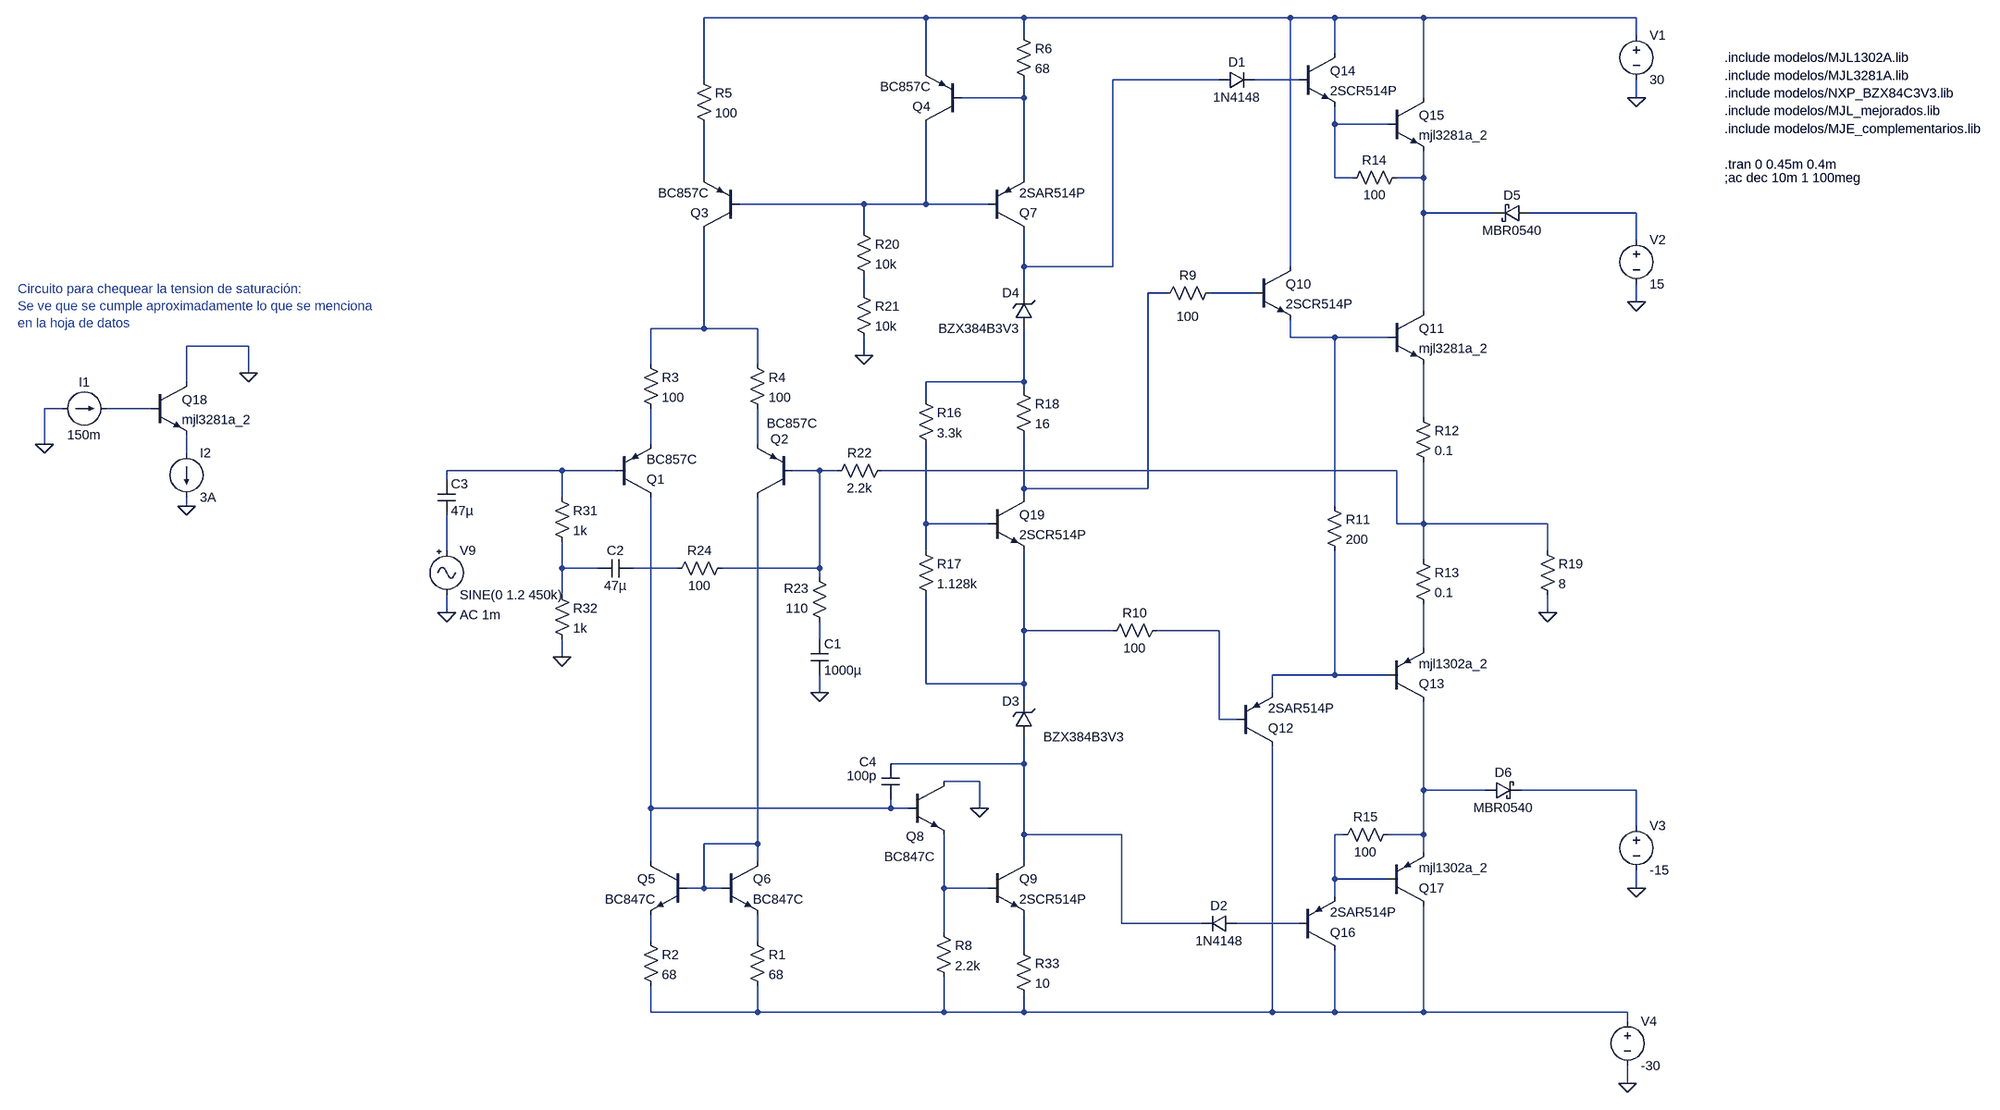
[diagram p0: schematic tp_final_amplificador.asc]
tp_final_amplificador.asc, the LTspice schematic file:
Version 4
SHEET 1 1772 1504
WIRE -1264 -640 -1664 -640
WIRE -1088 -640 -1264 -640
WIRE -608 -640 -1088 -640
WIRE -528 -640 -608 -640
WIRE -368 -640 -528 -640
WIRE 16 -640 -368 -640
WIRE -1088 -608 -1088 -640
WIRE 16 -608 16 -640
WIRE -528 -576 -528 -640
WIRE -1264 -544 -1264 -640
WIRE -1664 -528 -1664 -640
WIRE -736 -528 -928 -528
WIRE -592 -528 -672 -528
WIRE -1088 -496 -1088 -528
WIRE -1088 -496 -1200 -496
WIRE -368 -496 -368 -640
WIRE 16 -496 16 -528
WIRE -528 -448 -528 -480
WIRE -432 -448 -528 -448
WIRE -1664 -352 -1664 -448
WIRE -1088 -352 -1088 -496
WIRE -528 -352 -528 -448
WIRE -496 -352 -528 -352
WIRE -368 -352 -368 -400
WIRE -368 -352 -416 -352
WIRE -1376 -304 -1600 -304
WIRE -1264 -304 -1264 -448
WIRE -1264 -304 -1376 -304
WIRE -1152 -304 -1264 -304
WIRE -368 -288 -368 -352
WIRE -240 -288 -368 -288
WIRE 16 -288 -176 -288
WIRE -1376 -256 -1376 -304
WIRE 16 -240 16 -288
WIRE -1088 -192 -1088 -256
WIRE -928 -192 -928 -528
WIRE -928 -192 -1088 -192
WIRE -608 -192 -608 -640
WIRE -1376 -144 -1376 -176
WIRE -1088 -144 -1088 -192
WIRE -832 -144 -864 -144
WIRE -672 -144 -752 -144
WIRE 16 -128 16 -160
WIRE -368 -112 -368 -288
WIRE -1664 -80 -1664 -256
WIRE -1664 -80 -1760 -80
WIRE -1568 -80 -1664 -80
WIRE -608 -64 -608 -96
WIRE -528 -64 -608 -64
WIRE -432 -64 -528 -64
WIRE -3040 -48 -3152 -48
WIRE -1376 -32 -1376 -64
WIRE -1760 -16 -1760 -80
WIRE -1568 -16 -1568 -80
WIRE -3040 0 -3040 -48
WIRE -3152 16 -3152 -48
WIRE -1088 16 -1088 -80
WIRE -1088 16 -1264 16
WIRE -1088 32 -1088 16
WIRE -1264 48 -1264 16
WIRE -3376 64 -3408 64
WIRE -3216 64 -3296 64
WIRE -368 80 -368 -16
WIRE -3408 128 -3408 64
WIRE -1760 128 -1760 64
WIRE -1568 128 -1568 64
WIRE -3152 144 -3152 112
WIRE -1920 176 -2128 176
WIRE -1824 176 -1920 176
WIRE -1456 176 -1504 176
WIRE -1424 176 -1456 176
WIRE -416 176 -1344 176
WIRE -2128 192 -2128 176
WIRE -1088 208 -1088 112
WIRE -864 208 -864 -144
WIRE -864 208 -1088 208
WIRE -1920 224 -1920 176
WIRE -1088 224 -1088 208
WIRE -3152 240 -3152 224
WIRE -528 240 -528 -64
WIRE -1264 272 -1264 128
WIRE -1152 272 -1264 272
WIRE -416 272 -416 176
WIRE -368 272 -368 160
WIRE -368 272 -416 272
WIRE -144 272 -368 272
WIRE -2128 320 -2128 256
WIRE -1264 320 -1264 272
WIRE -144 320 -144 272
WIRE -368 336 -368 272
WIRE -1920 352 -1920 304
WIRE -1856 352 -1920 352
WIRE -1712 352 -1792 352
WIRE -1456 352 -1456 176
WIRE -1456 352 -1632 352
WIRE -1456 368 -1456 352
WIRE -1920 400 -1920 352
WIRE -2128 432 -2128 400
WIRE -144 432 -144 400
WIRE -1088 464 -1088 320
WIRE -928 464 -1088 464
WIRE -736 464 -848 464
WIRE -1456 480 -1456 448
WIRE -368 496 -368 416
WIRE -1920 512 -1920 480
WIRE -528 544 -528 320
WIRE -528 544 -640 544
WIRE -432 544 -528 544
WIRE -1264 560 -1264 400
WIRE -1088 560 -1088 464
WIRE -1088 560 -1264 560
WIRE -1456 576 -1456 544
WIRE -640 576 -640 544
WIRE -1088 592 -1088 560
WIRE -736 624 -736 464
WIRE -704 624 -736 624
WIRE -1088 704 -1088 656
WIRE -1088 704 -1328 704
WIRE -1168 736 -1232 736
WIRE -368 752 -368 592
WIRE -256 752 -368 752
WIRE 16 752 -192 752
WIRE -1760 784 -1760 224
WIRE -1328 784 -1328 768
WIRE -1328 784 -1760 784
WIRE -1296 784 -1328 784
WIRE -1168 784 -1168 736
WIRE 16 816 16 752
WIRE -1088 832 -1088 704
WIRE -912 832 -1088 832
WIRE -512 832 -528 832
WIRE -368 832 -368 752
WIRE -368 832 -432 832
WIRE -1568 848 -1568 224
WIRE -1568 848 -1664 848
WIRE -368 864 -368 832
WIRE -1760 880 -1760 784
WIRE -1568 880 -1568 848
WIRE -1088 880 -1088 832
WIRE -528 912 -528 832
WIRE -432 912 -528 912
WIRE -1664 928 -1664 848
WIRE -1664 928 -1696 928
WIRE -1632 928 -1664 928
WIRE -1232 928 -1232 832
WIRE -1152 928 -1232 928
WIRE 16 928 16 896
WIRE -528 944 -528 912
WIRE -912 992 -912 832
WIRE -768 992 -912 992
WIRE -592 992 -704 992
WIRE -1232 1008 -1232 928
WIRE -1760 1024 -1760 976
WIRE -1568 1024 -1568 976
WIRE -1088 1040 -1088 976
WIRE -1760 1152 -1760 1104
WIRE -1568 1152 -1568 1104
WIRE -1568 1152 -1760 1152
WIRE -1232 1152 -1232 1088
WIRE -1232 1152 -1568 1152
WIRE -1088 1152 -1088 1120
WIRE -1088 1152 -1232 1152
WIRE -640 1152 -640 672
WIRE -640 1152 -1088 1152
WIRE -528 1152 -528 1040
WIRE -528 1152 -640 1152
WIRE -368 1152 -368 960
WIRE -368 1152 -528 1152
WIRE 0 1152 -368 1152
WIRE 0 1168 0 1152
WIRE 0 1280 0 1248
FLAG -1168 784 0
FLAG -144 432 0
FLAG 0 1280 0
FLAG 16 928 0
FLAG 16 -128 0
FLAG 16 -496 0
FLAG -1376 -32 0
FLAG -1456 576 0
FLAG -1920 512 0
FLAG -2128 432 0
FLAG -3152 240 0
FLAG -3408 128 0
FLAG -3040 0 0
SYMBOL pnp -1824 224 M180
SYMATTR InstName Q1
SYMATTR Value BC857C
SYMBOL pnp -1504 224 R180
WINDOW 0 8 105 Left 2
WINDOW 3 -44 133 Left 2
SYMATTR InstName Q2
SYMATTR Value BC857C
SYMBOL pnp -1600 -256 R180
SYMATTR InstName Q3
SYMATTR Value BC857C
SYMBOL pnp -1200 -448 R180
SYMATTR InstName Q4
SYMATTR Value BC857C
SYMBOL npn -1696 880 M0
SYMATTR InstName Q5
SYMATTR Value BC847C
SYMBOL npn -1632 880 R0
SYMATTR InstName Q6
SYMATTR Value BC847C
SYMBOL res -1584 1008 R0
SYMATTR InstName R1
SYMATTR Value 68
SYMBOL res -1776 1008 R0
SYMATTR InstName R2
SYMATTR Value 68
SYMBOL res -1776 -32 R0
SYMATTR InstName R3
SYMATTR Value 100
SYMBOL res -1584 -32 R0
SYMATTR InstName R4
SYMATTR Value 100
SYMBOL res -1680 -544 R0
SYMATTR InstName R5
SYMATTR Value 100
SYMBOL res -1104 -624 R0
SYMATTR InstName R6
SYMATTR Value 68
SYMBOL pnp -1152 -256 M180
SYMATTR InstName Q7
SYMATTR Value 2SAR514P
SYMBOL npn -1296 736 R0
WINDOW 0 -4 99 Left 2
WINDOW 3 -43 136 Left 2
SYMATTR InstName Q8
SYMATTR Value BC847C
SYMBOL npn -1152 880 R0
SYMATTR InstName Q9
SYMATTR Value 2SCR514P
SYMBOL res -1248 992 R0
SYMATTR InstName R8
SYMATTR Value 2.2k
SYMBOL res -736 -160 R90
WINDOW 0 0 56 VBottom 2
WINDOW 3 43 56 VTop 2
SYMATTR InstName R9
SYMATTR Value 100
SYMBOL res -832 448 R90
WINDOW 0 0 56 VBottom 2
WINDOW 3 32 56 VTop 2
SYMATTR InstName R10
SYMATTR Value 100
SYMBOL npn -672 -192 R0
SYMATTR InstName Q10
SYMATTR Value 2SCR514P
SYMBOL npn -432 -112 R0
SYMATTR InstName Q11
SYMATTR Value mjl3281a_2
SYMBOL pnp -704 672 M180
SYMATTR InstName Q12
SYMATTR Value 2SAR514P
SYMBOL pnp -432 592 M180
SYMATTR InstName Q13
SYMATTR Value mjl1302a_2
SYMBOL res -544 224 R0
SYMATTR InstName R11
SYMATTR Value 200
SYMBOL res -384 64 R0
SYMATTR InstName R12
SYMATTR Value 0.1
SYMBOL res -384 320 R0
SYMATTR InstName R13
SYMATTR Value 0.1
SYMBOL npn -592 -576 R0
SYMATTR InstName Q14
SYMATTR Value 2SCR514P
SYMBOL npn -432 -496 R0
SYMATTR InstName Q15
SYMATTR Value mjl3281a_2
SYMBOL res -400 -368 R90
WINDOW 0 0 56 VBottom 2
WINDOW 3 32 56 VTop 2
SYMATTR InstName R14
SYMATTR Value 100
SYMBOL diode -736 -512 R270
WINDOW 0 32 32 VTop 2
WINDOW 3 0 32 VBottom 2
SYMATTR InstName D1
SYMATTR Value 1N4148
SYMBOL diode -704 976 R90
WINDOW 0 0 32 VBottom 2
WINDOW 3 32 32 VTop 2
SYMATTR InstName D2
SYMATTR Value 1N4148
SYMBOL pnp -592 1040 M180
SYMATTR InstName Q16
SYMATTR Value 2SAR514P
SYMBOL pnp -432 960 M180
SYMATTR InstName Q17
SYMATTR Value mjl1302a_2
SYMBOL res -416 816 R90
WINDOW 0 0 56 VBottom 2
WINDOW 3 32 56 VTop 2
SYMATTR InstName R15
SYMATTR Value 100
SYMBOL zener -1072 656 R180
WINDOW 0 24 64 Left 2
WINDOW 3 -165 0 Left 2
SYMATTR InstName D3
SYMATTR Value BZX384B3V3
SYMBOL npn -1152 224 R0
SYMATTR InstName Q19
SYMATTR Value 2SCR514P
SYMBOL res -1280 32 R0
SYMATTR InstName R16
SYMATTR Value 3.3k
SYMBOL res -1280 304 R0
SYMATTR InstName R17
SYMATTR Value 1.128k
SYMBOL res -1104 16 R0
SYMATTR InstName R18
SYMATTR Value 16
SYMBOL zener -1072 -80 R180
WINDOW 0 24 64 Left 2
WINDOW 3 24 0 Left 2
SYMATTR InstName D4
SYMATTR Value BZX384B3V3
SYMBOL res -160 304 R0
SYMATTR InstName R19
SYMATTR Value 8
SYMBOL schottky -176 -304 R90
WINDOW 0 0 32 VBottom 2
WINDOW 3 32 32 VTop 2
SYMATTR InstName D5
SYMATTR Value MBR0540
SYMATTR Description Diode
SYMATTR Type diode
SYMBOL schottky -256 768 R270
WINDOW 0 32 32 VTop 2
WINDOW 3 0 32 VBottom 2
SYMATTR InstName D6
SYMATTR Value MBR0540
SYMATTR Description Diode
SYMATTR Type diode
SYMBOL voltage 16 -624 R0
WINDOW 123 0 0 Left 0
WINDOW 39 0 0 Left 0
SYMATTR InstName V1
SYMATTR Value 30
SYMBOL voltage 16 -256 R0
WINDOW 123 0 0 Left 0
WINDOW 39 0 0 Left 0
SYMATTR InstName V2
SYMATTR Value 15
SYMBOL voltage 16 800 R0
WINDOW 123 0 0 Left 0
WINDOW 39 0 0 Left 0
SYMATTR InstName V3
SYMATTR Value -15
SYMBOL voltage 0 1152 R0
WINDOW 123 0 0 Left 0
WINDOW 39 0 0 Left 0
SYMATTR InstName V4
SYMATTR Value -30
SYMBOL res -1392 -272 R0
SYMATTR InstName R20
SYMATTR Value 10k
SYMBOL res -1392 -160 R0
SYMATTR InstName R21
SYMATTR Value 10k
SYMBOL res -1328 160 R90
WINDOW 0 0 56 VBottom 2
WINDOW 3 32 56 VTop 2
SYMATTR InstName R22
SYMATTR Value 2.2k
SYMBOL res -1440 464 R180
WINDOW 0 36 76 Left 2
WINDOW 3 36 40 Left 2
SYMATTR InstName R23
SYMATTR Value 110
SYMBOL cap -1472 480 R0
SYMATTR InstName C1
SYMATTR Value 1000µ
SYMBOL res -1616 336 R90
WINDOW 0 0 56 VBottom 2
WINDOW 3 32 56 VTop 2
SYMATTR InstName R24
SYMATTR Value 100
SYMBOL cap -1792 336 R90
WINDOW 0 0 32 VBottom 2
WINDOW 3 32 32 VTop 2
SYMATTR InstName C2
SYMATTR Value 47µ
SYMBOL res -1936 208 R0
SYMATTR InstName R31
SYMATTR Value 1k
SYMBOL res -1936 384 R0
SYMATTR InstName R32
SYMATTR Value 1k
SYMBOL cap -2144 192 R0
SYMATTR InstName C3
SYMATTR Value 47µ
SYMBOL res -1104 1024 R0
SYMATTR InstName R33
SYMATTR Value 10
SYMBOL Misc\\signal -2128 304 R0
WINDOW 123 24 132 Left 2
WINDOW 39 0 0 Left 0
SYMATTR Value2 AC 1m
SYMATTR InstName V9
SYMATTR Value SINE(0 1.2 450k)
SYMBOL cap -1344 704 R0
WINDOW 0 -40 -3 Left 2
WINDOW 3 -63 22 Left 2
SYMATTR InstName C4
SYMATTR Value 100p
SYMBOL npn -3216 16 R0
SYMATTR InstName Q18
SYMATTR Value mjl3281a_2
SYMBOL current -3376 64 R270
WINDOW 0 32 40 VTop 2
WINDOW 3 -32 40 VBottom 2
WINDOW 123 0 0 Left 0
WINDOW 39 0 0 Left 0
SYMATTR InstName I1
SYMATTR Value 150m
SYMBOL current -3152 144 R0
WINDOW 123 0 0 Left 0
WINDOW 39 0 0 Left 0
SYMATTR InstName I2
SYMATTR Value 3A
TEXT 528 -568 Left 2 !.include modelos/MJL1302A.lib
TEXT 528 -536 Left 2 !.include modelos/MJL3281A.lib
TEXT 528 -504 Left 2 !.include modelos/NXP_BZX84C3V3.lib
TEXT 528 -376 Left 2 !.tran 0 0.45m 0.4m
TEXT 528 -352 Left 2 !;ac dec 10m 1 100meg
TEXT 528 -472 Left 2 !.include modelos/MJL_mejorados.lib
TEXT -3456 -152 Left 2 ;Circuito para chequear la tension de saturación:\nSe ve que se cumple aproximadamente lo que se menciona\nen la hoja de datos
TEXT 528 -440 Left 2 !.include modelos/MJE_complementarios.lib

The netlist it stands for:
* tp_final_amplificador.asc
Q1 N036 N021 N018 0 BC857C
Q2 N038 N022 N019 0 BC857C
Q3 N013 N008 N006 0 BC857C
Q4 N008 N004 N001 0 BC857C
Q5 N036 N038 N041 0 BC847C
Q6 N038 N038 N042 0 BC847C
R1 N042 N044 68
R2 N041 N044 68
R3 N013 N018 100
R4 N013 N019 100
R5 N001 N006 100
R6 N001 N004 68
Q7 N002 N008 N004 0 2SAR514P
Q8 0 N036 N039 0 BC847C
Q9 N033 N039 N043 0 2SCR514P
R8 N039 N044 2.2k
R9 N012 N011 100
R10 N029 N028 100
Q10 N001 N012 N014 0 2SCR514P
Q11 N007 N014 N017 0 mjl3281a_2
Q12 N044 N029 N032 0 2SAR514P
Q13 N034 N032 N031 0 mjl1302a_2
R11 N014 N032 200
R12 N017 N023 0.1
R13 N023 N031 0.1
Q14 N001 N003 N005 0 2SCR514P
Q15 N001 N005 N007 0 mjl3281a_2
R14 N007 N005 100
D1 N002 N003 1N4148
D2 N040 N033 1N4148
Q16 N044 N040 N037 0 2SAR514P
Q17 N044 N037 N034 0 mjl1302a_2
R15 N034 N037 100
D3 N033 N028 BZX384B3V3
Q19 N011 N024 N028 0 2SCR514P
R16 N015 N024 3.3k
R17 N024 N028 1.128k
R18 N015 N011 16
D4 N015 N002 BZX384B3V3
R19 N023 0 8
D5 N009 N007 MBR0540
D6 N034 N035 MBR0540
V1 N001 0 30
V2 N009 0 15
V3 N035 0 -15
V4 N044 0 -30
R20 N008 N010 10k
R21 N010 0 10k
R22 N023 N022 2.2k
R23 N030 N022 110
C1 N030 0 1000µ
R24 N022 N027 100
C2 N027 N026 47µ
R31 N021 N026 1k
R32 N026 0 1k
C3 N021 N025 47µ
R33 N043 N044 10
V9 N025 0 SINE(0 1.2 450k) AC 1m
C4 N033 N036 100p
Q18 0 N016 N020 0 mjl3281a_2
I1 0 N016 150m
I2 N020 0 3A
.model D D
.lib standard.dio
.model NPN NPN
.model PNP PNP
.lib standard.bjt
.include modelos/MJL1302A.lib
.include modelos/MJL3281A.lib
.include modelos/NXP_BZX84C3V3.lib
.tran 0 0.45m 0.4m
;ac dec 10m 1 100meg
.include modelos/MJL_mejorados.lib
* Circuito para chequear la tension de saturación:
* Se ve que se cumple aproximadamente lo que se menciona
* en la hoja de datos
.include modelos/MJE_complementarios.lib
.backanno
.end